# EAGLE board LED_matrix (EAGLE 7.7.0)
DRAWING_NUMBER: B001; DRAWN: Mario Blunk / Blunk electronic; PROJECT: LED-Matrix; STATUS: EDUCATION
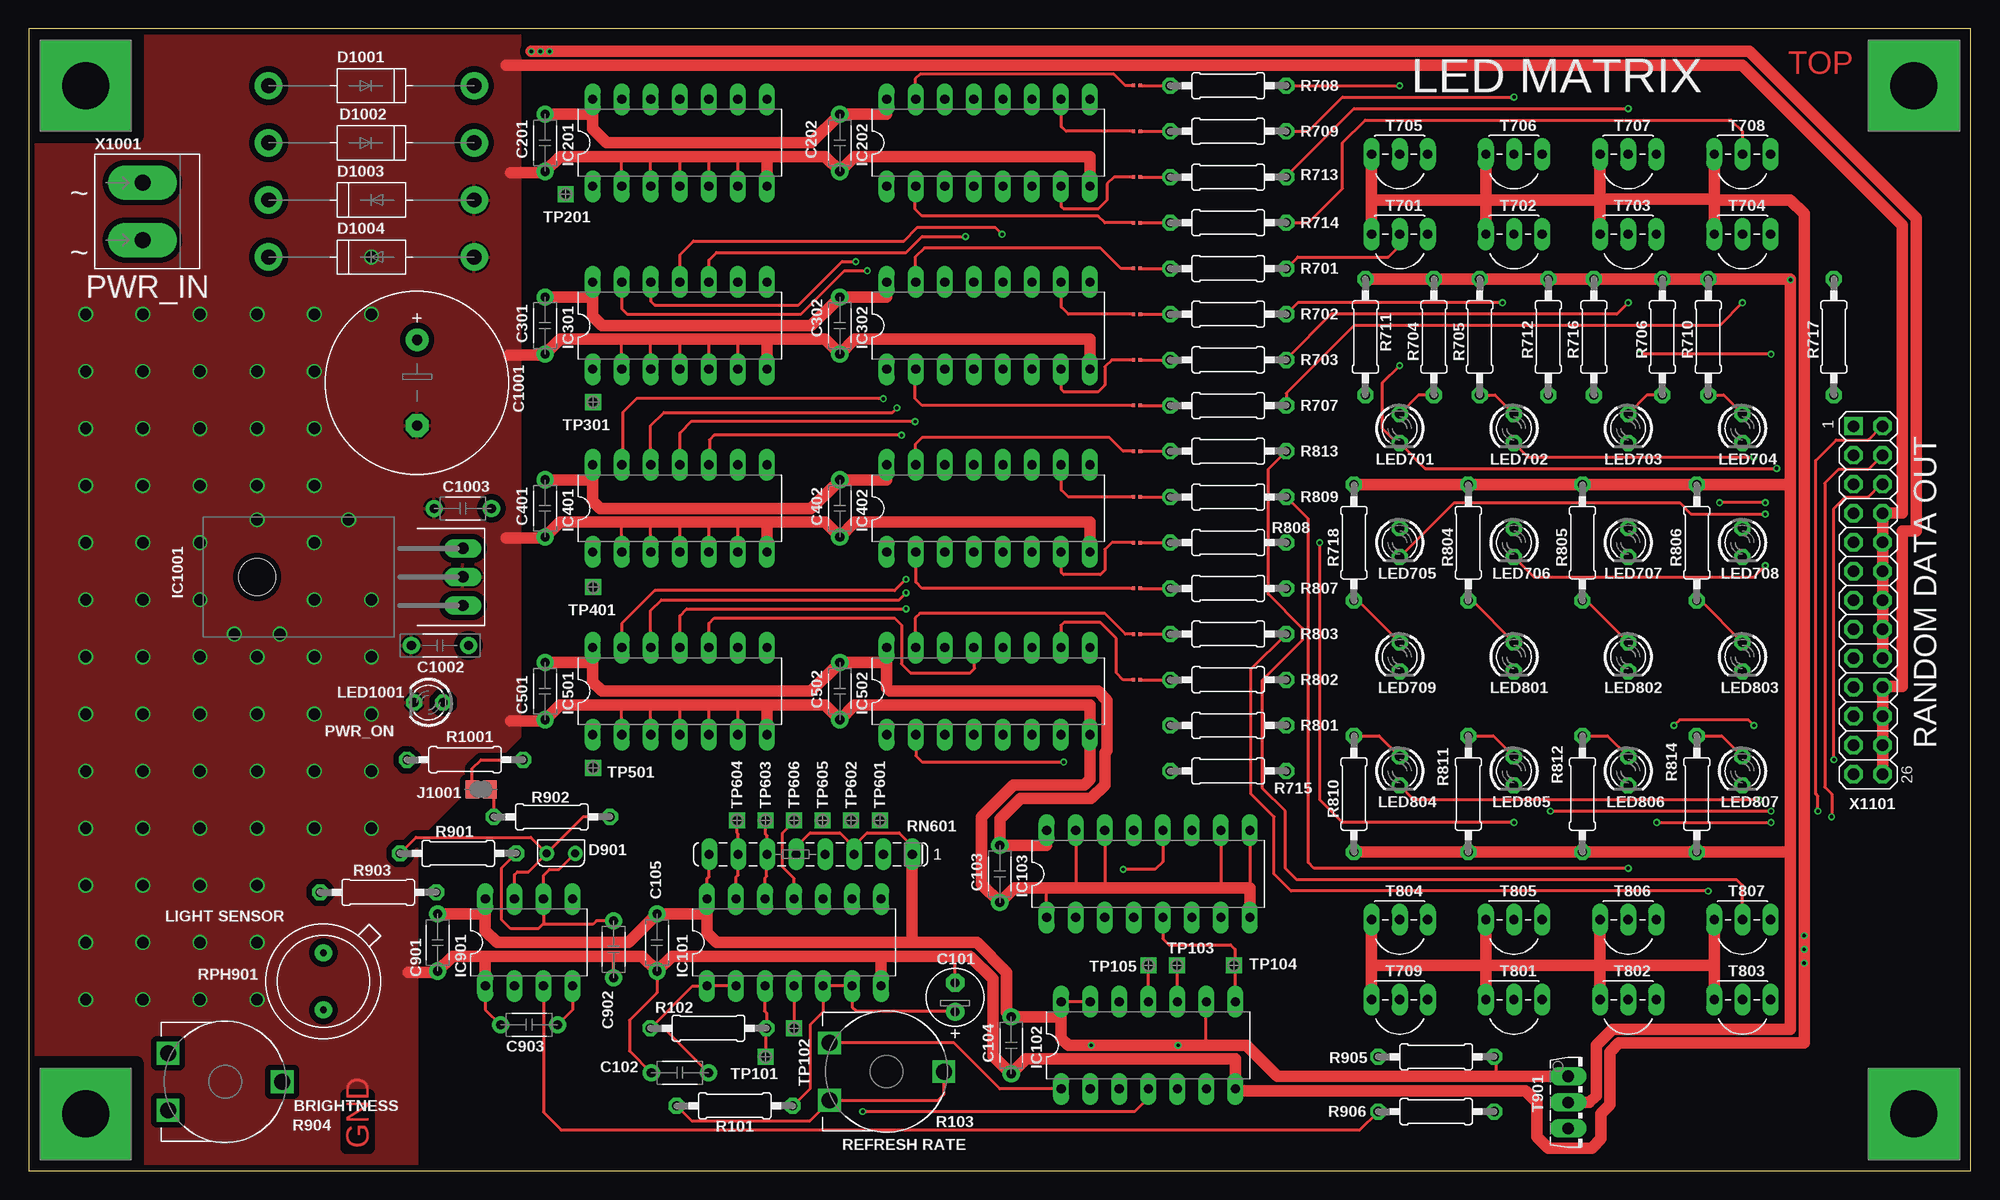
[diagram p11: board, top side]
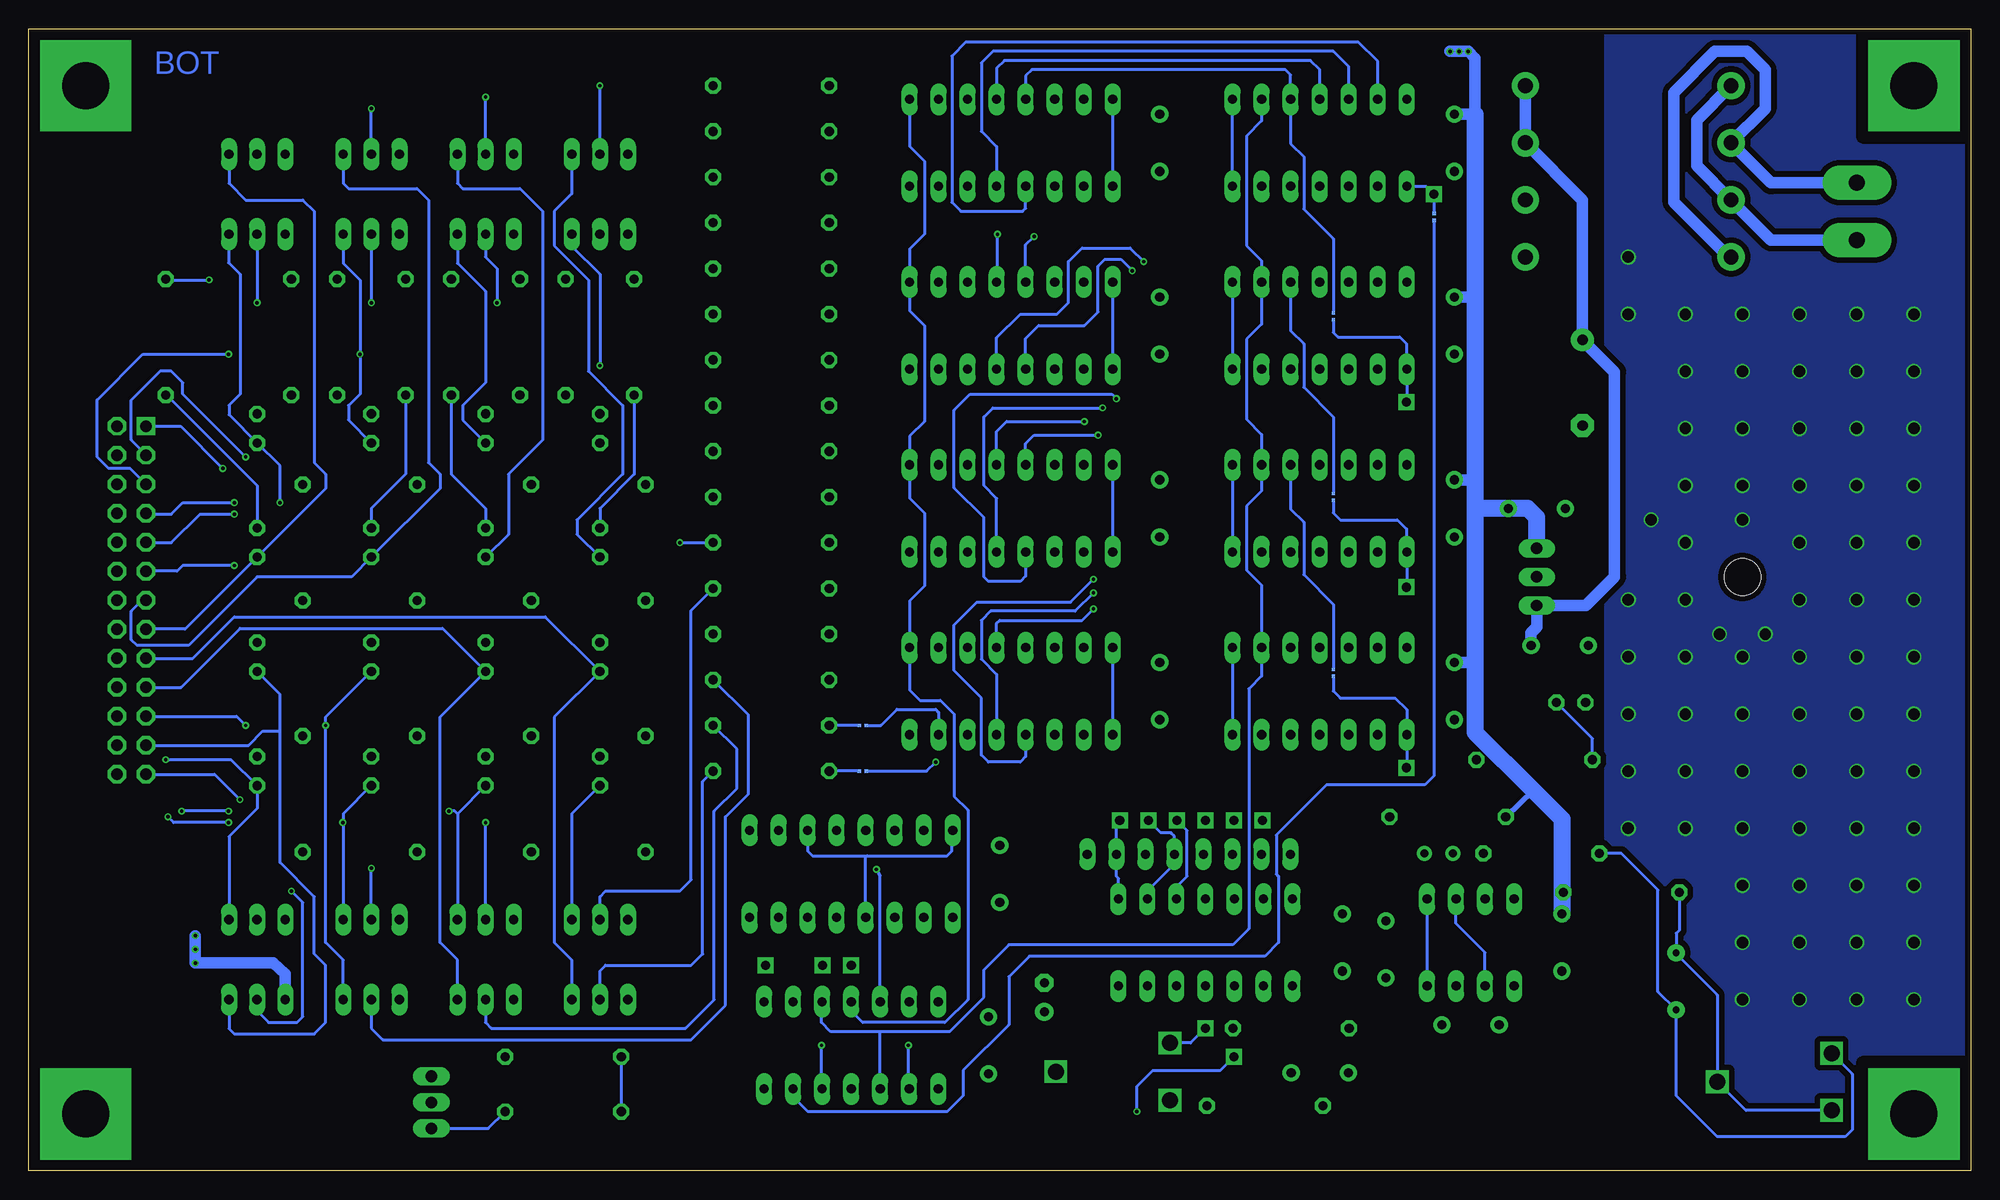
[diagram p12: board, bottom side, seen from below]

Size 170 x 100 mm. Coordinates in mm from the lower left corner, seen from the top.
Outline: 0,0 170,0 170,100 0,100 0,0
Copper layers (1*16): Top 0.035mm / dielectric 1.6mm / Bottom 0.035mm
Design rules "JLP_BL_std": minimum track width 0.15mm, minimum drill 0.3mm, track to track 0.15mm, track to pad 0.15mm, pad to pad 0.15mm, via to via 0.15mm, smd to smd 0.15mm, copper to edge 0.5mm, drill to drill 0.2mm, minimum pad ring 0.3mm, minimum via ring 0.15mm, stop-mask expansion 0.075mm, vias tented up to drill 0.3mm, thermal gap 0.2mm
Net classes: 1 pwr: width 0.3 mm

## Footprints (pad centres in the part's own frame; a part is rotated, then mirrored left to right if it is on the bottom)
T_RADIAL_5MM_GRID_2.54MM = drill 0.8 pad 1.6: + -1.27,0 | drill 0.8 pad 1.6 octagon: - 1.27,0
T_DISC_4MM_PITCH_5MM = drill 0.8 pad 1.5: 1 -2.5,0; 2 2.5,0
T_RADIAL_16MM_GRID_7.5MM = drill 0.9 pad 2: + -3.75,0 | drill 0.9 pad 2 octagon: - 3.75,0
T_DISC_7MM_PITCH_5MM = drill 0.8 pad 1.5: 1 -2.5,0; 2 2.5,0
T_MINIPLAST = drill 0.7: A 1.25,0; C -1.25,0
T_DO201_GRID_18MM = drill 1.3 pad 2.4: A -9,0; C 9,0
4.1_PAD = drill 4.1 pad 8 square: H1 0,0
T_NDIP14 = drill 0.8 long: 1 -7.62,-3.81; 2 -5.08,-3.81; 3 -2.54,-3.81; 4 0,-3.81; 5 2.54,-3.81; 6 5.08,-3.81; 7 7.62,-3.81; 8 7.62,3.81; 9 5.08,3.81; 10 2.54,3.81; 11 0,3.81; 12 -2.54,3.81; 13 -5.08,3.81; 14 -7.62,3.81
T_NDIP16 = drill 0.8 long: 1 -8.89,-3.81; 2 -6.35,-3.81; 3 -3.81,-3.81; 4 -1.27,-3.81; 5 1.27,-3.81; 6 3.81,-3.81; 7 6.35,-3.81; 8 8.89,-3.81; 9 8.89,3.81; 10 6.35,3.81; 11 3.81,3.81; 12 1.27,3.81; 13 -1.27,3.81; 14 -3.81,3.81; 15 -6.35,3.81; 16 -8.89,3.81
T_NDIP8 = drill 0.8 long: 1 -3.82,-3.81; 2 -1.28,-3.81; 3 1.26,-3.81; 4 3.8,-3.81; 5 3.8,3.81; 6 1.26,3.81; 7 -1.28,3.81; 8 -3.82,3.81
T_TO220-3_HORIZONTAL = drill 1 long: 1 -2.5,0; 2 0,0; 3 2.5,0 | hole 3.2: 0,18
S_SOLDER_JUMPER_NARROW = smd 1.168 x 1.6: 1 -0.762,0; 2 0.762,0
T_ROUND_3MM = drill 0.8 octagon: A -1.27,0; C 1.27,0
S_NET_CHANGER_0.3MM = smd 0.3 x 0.3: 1 -0.3,0; 2 0.3,0
T_0207_PITCH_10MM = drill 0.8 octagon: 1 -5.08,0; 2 5.08,0
T_TRIM_PIHER_PT10_HORIZONTAL = drill 1.4 square: A 2.5,-5; B -2.5,-5; W 0,5
T_SIL8 = drill 0.8 long: 1 -8.89,0; 2 -6.35,0; 3 -3.81,0; 4 -1.27,0; 5 1.27,0; 6 3.81,0; 7 6.35,0; 8 8.89,0
T_TO39-2 = drill 0.6 pad 1.5: 1 2.5,0; 2 -2.5,0
T_TO92-CBE = drill 0.813 long: B 0,0; C 2.46,0; E -2.46,0
T_TO126_VERTICAL = drill 1.016 long: B 2.286,-1.27; C 0,-1.27; E -2.286,-1.27
T_TEST_POINT_SMALL = drill 0.8 square: 1 0,0
T_WIRE_CLAMP_1X2_PITCH_5MM = drill 1.4 pad 3 long: 1 -2.5,-0.02; 2 2.5,-0.02
T_MALE_2X13_VERTICAL_PITCH_2MM54 = drill 1 square: 1 -15.2,-1.27 | drill 1 octagon: 2 -15.2,1.27; 3 -12.66,-1.27; 4 -12.66,1.27; 5 -10.12,-1.27; 6 -10.12,1.27; 7 -7.58,-1.27; 8 -7.58,1.27; 9 -5.04,-1.27; 10 -5.04,1.27; 11 -2.5,-1.27; 12 -2.5,1.27; 13 0.04,-1.27; 14 0.04,1.27; 15 2.58,-1.27; 16 2.58,1.27; 17 5.12,-1.27; 18 5.12,1.27; 19 7.66,-1.27; 20 7.66,1.27; 21 10.2,-1.27; 22 10.2,1.27; 23 12.74,-1.27; 24 12.74,1.27; 25 15.28,-1.27; 26 15.28,1.27

## Placement (x,y rotation side)
C101  1u  [T_RADIAL_5MM_GRID_2.54MM]  81.1,15.2 90 top
C102  100n  [T_DISC_4MM_PITCH_5MM]  57,8.6 180 top
C103  100n  [T_DISC_4MM_PITCH_5MM]  85,26 270 top
C104  100n  [T_DISC_4MM_PITCH_5MM]  86,11 270 top
C105  100n  [T_DISC_4MM_PITCH_5MM]  55,20 270 top
C201  100n  [T_DISC_4MM_PITCH_5MM]  45.2,90 270 top
C202  100n  [T_DISC_4MM_PITCH_5MM]  71,90 270 top
C301  100n  [T_DISC_4MM_PITCH_5MM]  45.2,74 270 top
C302  100n  [T_DISC_4MM_PITCH_5MM]  71,74 270 top
C401  100n  [T_DISC_4MM_PITCH_5MM]  45.2,58 270 top
C402  100n  [T_DISC_4MM_PITCH_5MM]  71,58 270 top
C501  100n  [T_DISC_4MM_PITCH_5MM]  45.2,42 270 top
C502  100n  [T_DISC_4MM_PITCH_5MM]  71,42 270 top
C901  100n  [T_DISC_4MM_PITCH_5MM]  35.8,20 270 top
C902  47n  [T_DISC_4MM_PITCH_5MM]  51.2,19.4 270 top
C903  10n  [T_DISC_4MM_PITCH_5MM]  43.8,12.8 180 top
C1001  470u  [T_RADIAL_16MM_GRID_7.5MM]  34,69 270 top
C1002  330n  [T_DISC_7MM_PITCH_5MM]  36,46 180 top
C1003  100n  [T_DISC_4MM_PITCH_5MM]  38,58 180 top
D901  SAY32  [T_MINIPLAST]  46.6,27.8 180 top
D1001  1N4001  [T_DO201_GRID_18MM]  30,95 0 top
D1002  1N4001  [T_DO201_GRID_18MM]  30,90 0 top
D1003  1N4001  [T_DO201_GRID_18MM]  30,85 180 top
D1004  1N4001  [T_DO201_GRID_18MM]  30,80 180 top
H601  HOLE_4.1_PAD  [4.1_PAD]  5,95 0 top
H602  HOLE_4.1_PAD  [4.1_PAD]  165,95 0 top
H603  HOLE_4.1_PAD  [4.1_PAD]  165,5 0 top
H604  HOLE_4.1_PAD  [4.1_PAD]  5,5 0 top
IC101  4093N  [T_NDIP14]  67,20 0 top
IC102  74LS00  [T_NDIP14]  98,11 0 top
IC103  74193N  [T_NDIP16]  98,26 0 top
IC201  7495N  [T_NDIP14]  57,90 0 top
IC202  74175N  [T_NDIP16]  84,90 0 top
IC301  7495N  [T_NDIP14]  57,74 0 top
IC302  74175N  [T_NDIP16]  84,74 0 top
IC401  7495N  [T_NDIP14]  57,58 0 top
IC402  74175N  [T_NDIP16]  84,58 0 top
IC501  7495N  [T_NDIP14]  57,42 0 top
IC502  74175N  [T_NDIP16]  84,42 0 top
IC901  NE555V  [T_NDIP8]  43.8,20 0 top
IC1001  7805_T_HORIZONTAL  [T_TO220-3_HORIZONTAL]  38,52 90 top
J1001  [S_SOLDER_JUMPER_NARROW]  39.6,33.4 180 top
LED701  [T_ROUND_3MM]  120,65 270 top
LED702  [T_ROUND_3MM]  130,65 270 top
LED703  [T_ROUND_3MM]  140,65 270 top
LED704  [T_ROUND_3MM]  150,65 270 top
LED705  [T_ROUND_3MM]  120,55 270 top
LED706  [T_ROUND_3MM]  130,55 270 top
LED707  [T_ROUND_3MM]  140,55 270 top
LED708  [T_ROUND_3MM]  150,55 270 top
LED709  [T_ROUND_3MM]  120,45 270 top
LED801  [T_ROUND_3MM]  130,45 270 top
LED802  [T_ROUND_3MM]  140,45 270 top
LED803  [T_ROUND_3MM]  150,45 270 top
LED804  [T_ROUND_3MM]  120,35 270 top
LED805  [T_ROUND_3MM]  130,35 270 top
LED806  [T_ROUND_3MM]  140,35 270 top
LED807  [T_ROUND_3MM]  150,35 270 top
LED1001  green  [T_ROUND_3MM]  35,41 180 top
N201  NET_CHANGER-S-0.3MM  [S_NET_CHANGER_0.3MM]  47,83.5 90 bottom
N301  NET_CHANGER-S-0.3MM  [S_NET_CHANGER_0.3MM]  55.8,74.8 270 bottom
N401  NET_CHANGER-S-0.3MM  [S_NET_CHANGER_0.3MM]  55.8,59 270 bottom
N501  NET_CHANGER-S-0.3MM  [S_NET_CHANGER_0.3MM]  55.8,43.6 270 bottom
N701  NET_CHANGER-S-0.3MM  [S_NET_CHANGER_0.3MM]  97,79 0 top
N702  NET_CHANGER-S-0.3MM  [S_NET_CHANGER_0.3MM]  97,75 0 top
N703  NET_CHANGER-S-0.3MM  [S_NET_CHANGER_0.3MM]  97,71 0 top
N704  NET_CHANGER-S-0.3MM  [S_NET_CHANGER_0.3MM]  97,67 0 top
N705  NET_CHANGER-S-0.3MM  [S_NET_CHANGER_0.3MM]  97,95 0 top
N706  NET_CHANGER-S-0.3MM  [S_NET_CHANGER_0.3MM]  97,91 0 top
N707  NET_CHANGER-S-0.3MM  [S_NET_CHANGER_0.3MM]  97,87 0 top
N708  NET_CHANGER-S-0.3MM  [S_NET_CHANGER_0.3MM]  97,83 0 top
N709  NET_CHANGER-S-0.3MM  [S_NET_CHANGER_0.3MM]  97,35 180 bottom
N801  NET_CHANGER-S-0.3MM  [S_NET_CHANGER_0.3MM]  97,39 180 bottom
N802  NET_CHANGER-S-0.3MM  [S_NET_CHANGER_0.3MM]  97,43 0 top
N803  NET_CHANGER-S-0.3MM  [S_NET_CHANGER_0.3MM]  97,47 0 top
N804  NET_CHANGER-S-0.3MM  [S_NET_CHANGER_0.3MM]  97,51 0 top
N805  NET_CHANGER-S-0.3MM  [S_NET_CHANGER_0.3MM]  97,55 0 top
N806  NET_CHANGER-S-0.3MM  [S_NET_CHANGER_0.3MM]  97,59 0 top
N807  NET_CHANGER-S-0.3MM  [S_NET_CHANGER_0.3MM]  97,63 0 top
R101  10k  [T_0207_PITCH_10MM]  61.8,5.7 180 top
R102  10k  [T_0207_PITCH_10MM]  59.5,12.5 0 top
R103  50k  [T_TRIM_PIHER_PT10_HORIZONTAL]  75.1,8.7 270 top
R701  2k7  [T_0207_PITCH_10MM]  105,79 0 top
R702  2k7  [T_0207_PITCH_10MM]  105,75 0 top
R703  2k7  [T_0207_PITCH_10MM]  105,71 0 top
R704  330  [T_0207_PITCH_10MM]  123,73 270 top
R705  330  [T_0207_PITCH_10MM]  127,73 270 top
R706  330  [T_0207_PITCH_10MM]  143,73 270 top
R707  2k7  [T_0207_PITCH_10MM]  105,67 0 top
R708  2k7  [T_0207_PITCH_10MM]  105,95 0 top
R709  2k7  [T_0207_PITCH_10MM]  105,91 0 top
R710  330  [T_0207_PITCH_10MM]  147,73 270 top
R711  330  [T_0207_PITCH_10MM]  117,73 270 top
R712  330  [T_0207_PITCH_10MM]  133,73 270 top
R713  2k7  [T_0207_PITCH_10MM]  105,87 0 top
R714  2k7  [T_0207_PITCH_10MM]  105,83 0 top
R715  2k7  [T_0207_PITCH_10MM]  105,35 0 top
R716  330  [T_0207_PITCH_10MM]  137,73 270 top
R717  330  [T_0207_PITCH_10MM]  158,73 270 top
R718  330  [T_0207_PITCH_10MM]  116,55 270 top
R801  2k7  [T_0207_PITCH_10MM]  105,39 0 top
R802  2k7  [T_0207_PITCH_10MM]  105,43 0 top
R803  2k7  [T_0207_PITCH_10MM]  105,47 0 top
R804  330  [T_0207_PITCH_10MM]  126,55 270 top
R805  330  [T_0207_PITCH_10MM]  136,55 270 top
R806  330  [T_0207_PITCH_10MM]  146,55 270 top
R807  2k7  [T_0207_PITCH_10MM]  105,51 0 top
R808  2k7  [T_0207_PITCH_10MM]  105,55 0 top
R809  2k7  [T_0207_PITCH_10MM]  105,59 0 top
R810  330  [T_0207_PITCH_10MM]  116,33 90 top
R811  330  [T_0207_PITCH_10MM]  126,33 90 top
R812  330  [T_0207_PITCH_10MM]  136,33 90 top
R813  2k7  [T_0207_PITCH_10MM]  105,63 0 top
R814  330  [T_0207_PITCH_10MM]  146,33 90 top
R901  1k2  [T_0207_PITCH_10MM]  37.6,27.8 180 top
R902  not fitted  [T_0207_PITCH_10MM]  45.8,31 180 top
R903  1k  [T_0207_PITCH_10MM]  30.6,24.4 0 top
R904  1M  [T_TRIM_PIHER_PT10_HORIZONTAL]  17.2,7.8 270 top
R905  10k  [T_0207_PITCH_10MM]  123.2,10 0 top
R906  330  [T_0207_PITCH_10MM]  123.2,5.2 0 top
R1001  330  [T_0207_PITCH_10MM]  38.2,36 180 top
RN601  10k  [T_SIL8]  68.45,27.72 180 top
RPH901  [T_TO39-2]  25.8,16.6 90 top
T701  BC548C  [T_TO92-CBE]  120,82 0 top
T702  BC548C  [T_TO92-CBE]  130,82 0 top
T703  BC548C  [T_TO92-CBE]  140,82 0 top
T704  BC548C  [T_TO92-CBE]  150,82 0 top
T705  BC548C  [T_TO92-CBE]  120,89 0 top
T706  BC548C  [T_TO92-CBE]  130,89 0 top
T707  BC548C  [T_TO92-CBE]  140,89 0 top
T708  BC548C  [T_TO92-CBE]  150,89 0 top
T709  BC548C  [T_TO92-CBE]  120,15 0 top
T801  BC548C  [T_TO92-CBE]  130,15 0 top
T802  BC548C  [T_TO92-CBE]  140,15 0 top
T803  BC548C  [T_TO92-CBE]  150,15 0 top
T804  BC548C  [T_TO92-CBE]  120,22 0 top
T805  BC548C  [T_TO92-CBE]  130,22 0 top
T806  BC548C  [T_TO92-CBE]  140,22 0 top
T807  BC548C  [T_TO92-CBE]  150,22 0 top
T901  BD136  [T_TO126_VERTICAL]  136,6 270 top
TP101  [T_TEST_POINT_SMALL]  64.5,10 180 top
TP102  [T_TEST_POINT_SMALL]  67,12.5 0 top
TP103  [T_TEST_POINT_SMALL]  100.5,18 0 top
TP104  [T_TEST_POINT_SMALL]  105.5,18 0 top
TP105  [T_TEST_POINT_SMALL]  98,18 0 top
TP201  [T_TEST_POINT_SMALL]  47,85.5 180 top
TP301  [T_TEST_POINT_SMALL]  49.4,67.3 180 top
TP401  [T_TEST_POINT_SMALL]  49.4,51.1 180 top
TP501  [T_TEST_POINT_SMALL]  49.4,35.3 180 top
TP601  [T_TEST_POINT_SMALL]  74.5,30.7 0 top
TP602  [T_TEST_POINT_SMALL]  72,30.7 180 top
TP603  [T_TEST_POINT_SMALL]  64.5,30.7 180 top
TP604  [T_TEST_POINT_SMALL]  62,30.7 180 top
TP605  [T_TEST_POINT_SMALL]  69.5,30.7 0 top
TP606  [T_TEST_POINT_SMALL]  67,30.7 0 top
U$1  [A4_LANDSCAPE]  -32.8,-56.4 0 top  (outside the outline)
X1001  CLAMP_1X2-T-5MM  [T_WIRE_CLAMP_1X2_PITCH_5MM]  10,84 270 top
X1101  MALE_2X13-T-VERTICAL_PITCH_2MM54  [T_MALE_2X13_VERTICAL_PITCH_2MM54]  161,50 270 top

## Tracks (layer width: path | path; a pad name or v marks a point on that pad's centre or on a via)
CLK_FAST
  Bottom 0.25: N201.1 47,34.6 47.8,33.8 56.4,33.8 60.8,29.4 60.8,26 60.6,25.8 60.6,20 61.8,18.8 82.4,18.8 84.2,17 84.2,12.8 88.2,8.8 88.2,6.6 89.6,5.2 101.8,5.2 103,6.4 103,7.11 IC102.6
CLK_FAST_OSC  (via drill 0.3)
  Top 0.25: IC101.3 64.4,16.13 64.4,14 64.58,13.82 R102.2 64.5,12.42 TP101.1 | IC102.4 98,6.4 96.8,5.2 v73,5.2
  Bottom 0.25: v73,5.2 73,7.4 71.6,8.8 65.7,8.8 TP101.1
CLK_FAST_RC
  Top 0.25: IC101.2 IC101.1 58.11,16.19 R102.1 55.6,12.5 C102.1
CLK_SLOW
  Top 0.25: IC102.8 105.62,17.88 TP104.1 105.6,18.1 105.6,19.4 105.2,19.8 99.8,19.8 99.27,20.33 IC103.5
CLK_SLOW_N
  Top 0.25: IC102.10 100.54,17.96 TP103.1
  Bottom 0.25: IC102.3 95.46,12.2 | 95.46,12.2 89.4,12.2 86.4,15.2 86.4,17.6 84.2,19.8 64.6,19.8 63.2,21.2 63.2,42.2 62.08,43.32 IC501.9 62.08,51.28 63.4,52.6 63.4,58.2 62.08,59.52 IC401.9 62.08,64.48 63.4,65.8 63.4,72.8 62.08,74.12 IC301.9 62.08,79.68 63.4,81 63.4,90.6 62.08,91.92 IC201.9 | 95.46,12.2 99.8,12.2 100.6,13 100.6,14.75 IC102.10
CLK_SLOW_OSC
  Top 0.25: IC101.4 TP102.1 | IC102.1 85.01,7.19 81,11.2 R103.B
  Bottom 0.25: TP102.1 68.3,11.2 R103.B
CLK_SLOW_RA
  Top 0.25: R101.2 58.02,4.4 68.4,4.4 70.1,6.1 R103.A 79.6,6.2 80.1,6.7 R103.W
CLK_SLOW_RC
  Top 0.25: R101.1 66.9,5.7 68.4,7.2 68.4,12.8 69.54,13.94 IC101.5 IC101.6 72.08,14.32 72.4,14 81.03,14 C101.+
CT_CO_N  (via drill 0.3)
  Top 0.25: IC103.12 99.27,27.07 98.6,26.4 v95.8,26.4
  Bottom 0.25: IC102.12 95.46,25.86 v95.8,26.4
DRV_IN_1
  Top 0.25: N701.2 R701.1
DRV_IN_2
  Top 0.25: N702.2 R702.1
DRV_IN_3
  Top 0.25: N703.2 R703.1
DRV_IN_4
  Top 0.25: N704.2 R707.1
DRV_IN_5
  Top 0.25: N705.2 R708.1
DRV_IN_6
  Top 0.25: N706.2 R709.1
DRV_IN_7
  Top 0.25: N707.2 R713.1
DRV_IN_8
  Top 0.25: N708.2 R714.1
DRV_IN_9
  Bottom 0.25: N709.2 R715.1
DRV_IN_10
  Bottom 0.25: N801.2 R801.1
DRV_IN_11
  Top 0.25: N802.2 R802.1
DRV_IN_12
  Top 0.25: N803.2 R803.1
DRV_IN_13
  Top 0.25: N804.2 R807.1
DRV_IN_14
  Top 0.25: N805.2 R808.1
DRV_IN_15
  Top 0.25: N806.2 R809.1
DRV_IN_16
  Top 0.25: N807.2 R813.1
DRV_IN_B1
  Top 0.25: R701.2 111.08,80 119,80 120,81 T701.B
DRV_IN_B2  (via drill 0.3)
  Top 0.25: v129,76 111.08,76 R702.2
  Bottom 0.25: T702.B 130,80 129,79 v129,76
DRV_IN_B3  (via drill 0.3)
  Top 0.25: v140,76 139,75 114,75 110.08,71.08 R703.2
  Bottom 0.25: T703.B v140,76
DRV_IN_B4  (via drill 0.3)
  Top 0.25: v150,76 148,74 116,74 110.08,68.08 R707.2
  Bottom 0.25: T704.B v150,76
DRV_IN_B5  (via drill 0.3)
  Top 0.25: R708.2 v120,95
  Bottom 0.25: T705.B v120,95
DRV_IN_B6  (via drill 0.3)
  Top 0.25: R709.2 112,91 115,94 v130,94
  Bottom 0.25: T706.B v130,94
DRV_IN_B7  (via drill 0.3)
  Top 0.25: R713.2 110.08,87.08 116,93 v140,93
  Bottom 0.25: T707.B v140,93
DRV_IN_B8
  Top 0.25: R714.2 112,83 115,86 115,90 117,92 149,92 150,91 T708.B
DRV_IN_B9
  Bottom 0.25: T709.B 120,17.5 119.5,18 112,18 111,19 111,34.08 R715.2
DRV_IN_B10
  Bottom 0.25: T801.B 130,13 129.5,12.5 112.5,12.5 110,15 110,31.5 108,33.5 108,36.92 R801.2
DRV_IN_B11
  Bottom 0.25: T802.B 140,12.5 139,11.5 112,11.5 109,14.5 109,31 107,33 107,39.92 R802.2
DRV_IN_B12  (via drill 0.3)
  Top 0.25: v147,24.5 110.5,24.5 109,26 109,31 107,33 107,43.92 R803.2
  Bottom 0.25: T803.B 150,14 149,13 146.5,13 146,13.5 146,23.5 v147,24.5
DRV_IN_B13
  Bottom 0.25: T804.B 120,24 119.5,24.5 113,24.5 112,25.5 112,49.08 R807.2
DRV_IN_B14  (via drill 0.3)
  Top 0.25: v130,30.5 115,30.5 113,32.5 v113,55
  Bottom 0.25: T805.B v130,30.5 | v113,55 R808.2
DRV_IN_B15  (via drill 0.3)
  Top 0.25: v140,26.5 112.5,26.5 112,27 112,57.08 R809.2
  Bottom 0.25: T806.B v140,26.5
DRV_IN_B16
  Top 0.25: T807.B 150,25 149.5,25.5 111,25.5 110,26.5 110,31.5 108,33.5 108,43 111.5,46.5 111.5,47.5 108.5,50.5 108.5,61.42 R813.2
DRV_OUT_1  (via drill 0.3)
  Top 0.25: v120,70.5 118.5,69 118.5,65 119.77,63.73 LED701.C 122.23,61.5 v153,61.5
  Bottom 0.25: T701.C 122.46,80.96 120,78.5 v120,70.5 | X1101.1 156.7,65.2 v153,61.5
DRV_OUT_2  (via drill 0.3)
  Top 0.25: LED702.C 131.23,62.5 v151,62.5
  Bottom 0.25: T702.C 132.46,79.46 130,77 130,69 132,67 132,65.73 LED702.C | X1101.3 159.73,62.73 161,64 161,67.5 158.5,70 157.5,70 156.5,69 156.5,68 v151,62.5
DRV_OUT_3  (via drill 0.3)
  Top 0.25: v152.5,71.5 v141,71.5
  Bottom 0.25: T703.C 142.46,79.46 141,78 v141,71.5 141,68 142,67 142,65.73 LED703.C | X1101.5 161.11,61.5 163,61.5 164,62.5 164,67.5 160,71.5 v152.5,71.5
DRV_OUT_4  (via drill 0.3)
  Top 0.25: v152,58.5 v148,58.5
  Bottom 0.25: T704.C 152.5,79.5 151.5,78.5 151.5,68 152.46,67.04 152.46,66.19 LED704.C 148,61.73 v148,58.5 | X1101.7 159.65,57.5 157.5,57.5 156.5,58.5 v152,58.5
DRV_OUT_5  (via drill 0.3)
  Top 0.25: LED705.C 124.77,58.5 144.5,58.5 145.5,57.5 v152,57.5
  Bottom 0.25: T705.C 122.46,85.54 124,84 124,81 121,78 121,70 118,67 118,61 122,57 122,55.73 LED705.C | X1101.9 159.69,55 157.5,55 155,57.5 v152,57.5
DRV_OUT_6  (via drill 0.3)
  Top 0.25: LED706.C 131.73,52 151,52 v152,53
  Bottom 0.25: T706.C 132.46,86.46 132,86 127,86 125,84 125,64 128,61 128,55.73 LED706.C | v152,53 156.5,53 157,52.5 X1101.11
DRV_OUT_7
  Bottom 0.25: T707.C 142.46,86.46 142,86 136,86 135,85 135,62 134,61 134,59.73 LED707.C 141.73,52 150,52 156,46 160.5,46 161,46.5 161,49 160.04,49.96 X1101.13
DRV_OUT_8
  Bottom 0.25: T708.C 152.46,86.46 151,85 146,85 145,84 145,62 144,61 144,59.73 LED708.C 156.31,47.42 X1101.15
DRV_OUT_9
  Bottom 0.25: T709.C 122.46,18.46 124,20 124,39.73 LED709.C 124.77,48.5 152,48.5 155.62,44.88 X1101.17
DRV_OUT_10
  Bottom 0.25: T801.C 132.46,18.46 134,20 134,39.73 LED801.C 133.77,47.5 151.5,47.5 156.66,42.34 X1101.19
DRV_OUT_11  (via drill 0.3)
  Top 0.25: v151,39 150.5,39.5 144.5,39.5 v144,39
  Bottom 0.25: T802.C 142.46,18.46 144,20 v144,39 144,39.73 LED802.C | X1101.21 151.8,39.8 v151,39
DRV_OUT_12
  Bottom 0.25: T803.C 152.46,12.46 152,12 145,12 144,13 144,18 145,19 145,24 148,27 148,38.5 | 148,38.5 148,41.73 LED803.C | X1101.23 150.74,37.26 149.5,38.5 148,38.5
DRV_OUT_13  (via drill 0.3)
  Top 0.25: v151.5,32.5 121.23,32.5 LED804.C
  Bottom 0.25: LED804.C 122.46,31.27 T804.C | X1101.25 153.72,34.72 v151.5,32.5
DRV_OUT_14  (via drill 0.3)
  Top 0.25: v133.2,31.5 v152.5,31.5 | v156.6,31.5 156.6,32.8 156.4,33 156.4,62.2 158.2,64 161,64 162.2,65.2 X1101.2
  Bottom 0.25: LED805.C 132.46,31.27 | 132.46,31.27 T805.C | 132.46,31.27 132.69,31.5 v133.2,31.5 | v152.5,31.5 v156.6,31.5
DRV_OUT_15  (via drill 0.3)
  Top 0.25: v142.5,30.5 v152.5,30.5 | X1101.4 161.01,61.4 158.4,61.4 157.2,60.2 157.2,33.6 157.8,33 v157.8,31
  Bottom 0.25: LED806.C 142.46,31.27 142.46,30.5 | 142.46,30.5 T806.C | v142.5,30.5 142.46,30.5 | v152.5,30.5 157.3,30.5 v157.8,31
DRV_OUT_16  (via drill 0.3)
  Top 0.25: v158,36 158,58 159,59 161,59 162.12,60.12 X1101.6
  Bottom 0.25: T807.C 152.46,29.27 150,31.73 LED807.C 152.27,36 v158,36
DRV_OUT_A_1
  Top 0.25: R704.2 121.65,67.92 LED701.A
DRV_OUT_A_2
  Top 0.25: R705.2 128.35,67.92 LED702.A
DRV_OUT_A_3
  Top 0.25: R706.2 141.65,67.92 LED703.A
DRV_OUT_A_4
  Top 0.25: R710.2 148.35,67.92 LED704.A
DRV_OUT_A_5
  Bottom 0.25: R711.2 117,61 120,58 LED705.A
DRV_OUT_A_6
  Bottom 0.25: R712.2 133,61 130,58 LED706.A
DRV_OUT_A_7
  Bottom 0.25: R716.2 137,61 140,58 LED707.A
DRV_OUT_A_8
  Bottom 0.25: R717.2 157.92,67.92 150,60 LED708.A
DRV_OUT_A_9
  Top 0.25: R718.2 116.35,49.92 LED709.A
DRV_OUT_A_10
  Top 0.25: R804.2 126.35,49.92 LED801.A
DRV_OUT_A_11
  Top 0.25: R805.2 136.35,49.92 LED802.A
DRV_OUT_A_12
  Top 0.25: R806.2 146.35,49.92 LED803.A
DRV_OUT_A_13
  Top 0.25: R810.2 118.19,38.08 LED804.A
DRV_OUT_A_14
  Top 0.25: R811.2 128.19,38.08 LED805.A
DRV_OUT_A_15
  Top 0.25: R812.2 138.19,38.08 LED806.A
DRV_OUT_A_16
  Top 0.25: R814.2 148.19,38.08 LED807.A
GND  (via drill 0.3, 1)
  Top 0.25: IC201.2 51.92,88.72 52,88.8 | IC201.3 54.46,88.34 54,88.8 | IC201.4 57,88.8 | IC201.5 59.54,88.34 60,88.8 | IC201.6 62.08,88.72 62,88.8 | IC301.2 51.92,72.72 52,72.8 | IC301.3 54.46,72.8 55,72.8 | IC301.4 57,72.8 | IC301.5 59.54,72.8 59,72.8 | IC301.6 62.08,72.8 62,72.8 | IC401.2 51.92,56.8 52,56.8 | IC401.3 54.46,56.8 55,56.8 | IC401.4 57,56.8 | IC401.5 59.54,56.8 59,56.8 | IC401.6 62.08,56.8 62,56.8 | IC501.2 51.92,40.8 52,40.8 | IC501.3 54.46,40.8 55,40.8 | IC501.4 57,40.8 | IC501.5 59.54,40.8 59,40.8 | IC501.6 62.08,40.8 62,40.8 | IC103.15 91.65,24.8 92,24.8 | IC103.14 94.19,24.8 94,24.8 | IC103.10 104.35,25 105,25 105,24.8 | IC103.9 106.89,24.8 | IC103.1 89.11,24.8 89,24.8 | IC901.1 39.98,14.12 C903.2 | C902.2 51.2,18.8 | C105.2 55,15.6 52.6,13.2 52.6,10.5 C102.2 | C101.- 81.1,18.7 81,18.8
  Top 1: IC202.8 92.89,88.8 72.3,88.8 C202.2 69.7,88.8 64.6,88.8 | 64.6,88.8 62,88.8 60,88.8 57,88.8 54,88.8 52,88.8 46.5,88.8 C201.2 45.1,87.4 42.2,87.4 | IC201.7 64.62,88.78 64.6,88.8 | IC302.8 92.89,72.8 72.3,72.8 C302.2 69.7,72.8 64.6,72.8 | 64.6,72.8 62,72.8 59,72.8 57,72.8 55,72.8 52,72.8 46.5,72.8 C301.2 45.1,71.4 42,71.4 | IC301.7 64.62,72.78 64.6,72.8 | IC402.8 92.89,56.8 72.3,56.8 C402.2 69.7,56.8 64.62,56.8 | 64.62,56.8 62,56.8 59,56.8 57,56.8 55,56.8 52,56.8 46.5,56.8 C401.2 45.1,55.4 41.8,55.4 | IC401.7 64.62,56.8 | 64.8,40.8 69.7,40.8 C502.2 72.3,40.8 92.89,40.8 IC502.8 92.89,34.29 92.4,33.8 86.2,33.8 83.4,31 83.4,25.1 C103.2 86.3,24.8 89,24.8 92,24.8 94,24.8 105,24.8 106.89,24.8 IC103.8 | 64.8,40.8 62,40.8 59,40.8 57,40.8 55,40.8 52,40.8 46.5,40.8 C501.2 45.1,39.4 42.2,39.4 | IC501.7 64.62,40.62 64.8,40.8 | IC101.7 74.62,18.8 | 74.62,18.8 56.3,18.8 C105.2 53.7,18.8 51.2,18.8 39.98,18.8 | 74.62,18.8 81,18.8 82.4,18.8 84.4,16.8 84.4,10.1 C104.2 87.3,9.8 105.62,9.8 IC102.7 105.81,7 131,7 132,6 132,3 133,2 136.8,2 137.6,2.8 137.6,5 138.4,5.8 138.4,10.4 139.2,11.2 155.4,11.2 v155.4,18.2 v155.4,19.4 v155.4,20.6 155.4,83.8 154.2,85 147.54,85 | 39.98,18.8 37.1,18.8 C901.2 35.7,17.4 33.2,17.4 | IC901.1 39.98,18.8 | T708.E 147.54,85.05 | 147.54,85.05 147.54,85 | 147.54,85 T704.E | T707.E 137.54,85 | 137.54,85 T703.E | T706.E 127.54,85 | 127.54,85 T702.E | T705.E 117.54,85 | 117.54,85 T701.E | 147.54,85.05 137.59,85.05 137.54,85 | 137.54,85 127.54,85 | 127.54,85 117.54,85 | T807.E 147.54,18.15 | 147.54,18.15 T803.E | T806.E 137.54,18 | 137.54,18 T802.E | T805.E 127.54,18 | 127.54,18 T801.E
  Top 1: T804.E 117.54,18 | 117.54,18 T709.E | 147.54,18.15 147.39,18 137.54,18 | 137.54,18 127.54,18 | 127.54,18 117.54,18 | X1101.18 X1101.16 X1101.14 X1101.12 X1101.10 X1101.8 164,57.58 164,82.8 150,96.8 41.8,96.8
  Bottom 0.25: IC201.7 IC201.8 | IC301.8 IC301.7 | IC501.8 IC501.7 | IC401.8 IC401.7
  Bottom 1: T803.E 147.54,17.26 148.6,18.2 v155.4,18.2 v155.4,19.4 v155.4,20.6
  other vias: 5,75 10,75 15,75 20,75 5,70 10,70 15,70 20,70 25,75 25,70 20,65 25,65 15,65 10,65 5,65 5,60 10,60 10,55 10,50 5,50 5,45 10,45 5,40 10,40 15,40 20,40 25,40 25,35 20,35 15,35 10,35 5,35 5,30 10,30 15,30 20,30 25,30 5,25 10,25 15,25 20,25 20,20 15,20 10,20 5,20 5,15 10,15 15,15 20,15 30,40 30,35 30,30 30,75 30,80 5,55 15,60 20,60 25,60 15,55 15,50 15,45 20,45 25,45 30,45 25,50 25,55 30,50 20,57 28,57 22,47 18,47
  pour Top (isolate 0.5): 43,100 0,100 0,0 34,0 34,29 43,38
  pour Bottom (isolate 0.5): 0,100 32,100 32,0 0,0
P5V  (via drill 0.3)
  Top 0.25: J1001.1 40.72,33.04 R902.2 | IC102.13 IC102.14 | IC101.14 59.4,23.83 59.4,25.6 59.56,25.76 RN601.8 | RN601.5 67.18,28.38 68.4,29.6 71,29.6 72.26,28.34 RN601.3 72.26,28.46 73.4,29.6 76.2,29.6 77.34,28.46 RN601.1 | R905.2 128.4,9.88 128.4,8.29 | IC102.9 103,14.81 103,11
  Top 1: IC202.16 75.11,92.5 C202.1 68.5,90 50.6,90 49.38,91.22 IC201.14 49.38,92.5 C201.1 | IC302.16 75.11,76.5 C302.1 68.5,74 50.2,74 49.38,74.82 IC301.14 49.38,76.5 C301.1 | IC401.14 49.38,60.5 | 49.38,60.5 C401.1 | IC402.16 75.11,60.5 C402.1 68.5,58 50,58 49.38,58.62 49.38,60.5 | IC502.16 75.11,44.5 | 75.11,44.5 C502.1 68.5,42 50.2,42 49.38,42.82 IC501.14 49.38,44.5 C501.1 | IC103.16 89.11,28.5 C103.1 85,30.8 86.8,32.6 93,32.6 94.2,33.8 94.2,36.6 94.4,36.8 94.4,41.2 93.6,42 75.4,42 75.11,42.29 75.11,44.5 | IC102.14 90.38,13.5 | 90.38,13.5 C104.1 85.6,13.9 85.6,17.4 83,20 77.34,20 | 77.34,20 60.2,20 59.38,20.82 IC101.14 59.38,22.5 C105.1 52.5,20 41,20 39.98,21.02 IC901.8 39.98,22.5 C901.1 | 77.34,20 RN601.1 | 90.38,13.5 90.38,11.62 91,11 v93,11 v100.6,11 103,11 106.6,11 109.31,8.29 128.4,8.29 T901.E | X1101.26 X1101.24 X1101.22 X1101.20 162.27,42.4 164,42.4 164,56 165.2,56 165.2,83.4 150.6,98 v45.6,98 v44.8,98 v44,98
  Bottom 0.25: IC202.1 IC202.16 | IC302.1 IC302.16 | IC402.1 IC402.16 | IC502.1 IC502.16 | IC103.11 101.81,28.01 101.4,27.6 96.6,27.6 | 96.6,27.6 89.6,27.6 89.2,28 89.2,29.72 IC103.16 | IC103.4 96.73,27.47 96.6,27.6 | IC102.2 arc90 93,7.27 v93,11 | IC102.5 arc90 100.6,7.25 v100.6,11 | R903.2 35.68,24.68 35.8,24.8
  Bottom 0.5: R902.2 38.3,33.3
  Bottom 1: C201.1 43.4,92.5 43.4,97.4 v44,98 v45.6,98 | 43.4,76.5 C301.1 | 43.4,60.5 C401.1 | 43.4,44.5 C501.1
  Bottom 1.5: 43.4,92.5 43.4,76.5 43.4,60.5 43.4,58 | 43.4,58 43.4,44.5 43.4,38.4 38.3,33.3 35.8,30.8 35.8,24.8 C901.1 | IC1001.3 38,57.2 38.8,58 C1003.1 43.4,58
PWR_IN_AC1
  Bottom 1: X1001.2 17.5,81.5 D1003.C 24,88 24,92 D1001.A
PWR_IN_AC2
  Bottom 1: X1001.1 17.5,86.5 D1002.A 18,93 18,96.4 19.6,98 22.4,98 26,94.4 26,84.8 21.2,80 D1004.C
PWR_IN_VREG
  Bottom 1: C1002.1 38.5,47.1 38,47.6 IC1001.1 33.7,49.5 31.2,52 31.2,69.95 C1001.+ 34,85 D1002.C D1001.C
PWR_LED
  Bottom 0.25: R1001.2 33.12,37.85 LED1001.A
PWR_LED_JP
  Top 0.25: J1001.2 38.84,35.24 39.6,36 R1001.1
REG_1_QA
  Top 0.25: N708.1 94.2,83 93.6,83.6 78.2,83.6 77.6,84.2 77.6,86.14 IC202.2
REG_1_QB
  Top 0.25: N707.1 95,87 94.4,86.4 94.4,85 93.6,84.2 90.6,84.2 90.4,84.4 90.4,86.14 IC202.7
REG_1_QC
  Top 0.25: N706.1 90.8,91 90.4,91.4 90.4,93.76 IC202.10
REG_1_QD
  Top 0.25: N705.1 96,95 95,96 78,96 77.6,95.6 77.6,93.86 IC202.15
REG_2_QA
  Top 0.25: N704.1 78.2,67 77.6,67.6 77.6,70.14 IC302.2
REG_2_QB
  Top 0.25: N703.1 94.8,71 94.2,70.4 94.2,68.8 93.6,68.2 90.6,68.2 90.4,68.4 90.4,70.14 IC302.7
REG_2_QC
  Top 0.25: N702.1 91,75 90.4,75.6 90.4,77.76 IC302.10
REG_2_QD
  Top 0.25: N701.1 95.6,79 93.8,80.8 78.4,80.8 77.6,80 77.6,77.86 IC302.15
REG_3_QA
  Top 0.25: N804.1 78.2,51 77.65,51.55 IC402.2
REG_3_QB
  Top 0.25: N805.1 94.8,55 94.2,54.4 94.2,52.6 93.8,52.2 90.6,52.2 90.4,52.4 90.4,54.14 IC402.7
REG_3_QC
  Top 0.25: N806.1 91,59 90.4,59.6 90.4,61.76 IC402.10
REG_3_QD
  Top 0.25: N807.1 95.8,63 94.6,64.2 78.2,64.2 77.6,63.6 77.6,61.86 IC402.15
REG_4_QA  (via drill 0.3)
  Top 0.25: IC502.2 77.65,36.35 78.2,35.8 v90.6,35.8
  Bottom 0.25: N709.1 91.4,35 v90.6,35.8
REG_4_QB
  Bottom 0.25: N801.1 95.4,39 94,40.4 90.6,40.4 90.35,40.15 IC502.7
REG_4_QC
  Top 0.25: N802.1 95.8,43 95.2,43.6 95.2,46.6 93.8,48 90.6,48 90.35,47.75 IC502.10
REG_4_QD
  Top 0.25: N803.1 96,47 94.2,48.8 78,48.8 77.6,48.4 77.6,45.86 IC502.15
REG_LOAD
  Top 0.25: IC102.11 TP105.1
  Bottom 0.25: IC202.9 92.89,89.69 91.6,88.4 91.6,82 92.89,80.71 IC302.9 92.89,75.29 91.6,74 91.6,65.6 92.89,64.31 IC402.9 92.89,58.89 91.6,57.6 91.6,51.2 92.89,49.91 IC502.9 92.89,42.09 92,41.2 90.2,41.2 89,40 89,32.8 87.8,31.6 87.8,15 89.8,13 97,13 97.8,13.8 97.8,14.61 IC102.11
RSV_IN_1
  Bottom 0.25: TP601.1 74.8,30.4 RN601.2 74.8,25.8 74.6,25.6 74.6,23.83 IC101.8
RSV_IN_2
  Bottom 0.25: TP602.1 70.9,29.6 70,29.6 69.72,29.32 RN601.4 69.72,26.88 72.08,24.52 IC101.9
RSV_IN_3
  Top 0.25: IC101.12 64.46,25.66 64.6,25.8 64.6,27.68 RN601.6 64.64,29.36 64.5,29.5 TP603.1
RSV_IN_4
  Top 0.25: IC101.13 61.92,25.72 62.1,25.9 RN601.7 62.1,29.5 62,29.6 TP604.1
RSV_OUT_1
  Bottom 0.25: IC101.10 69.54,24.86 68.6,25.8 68.6,29.8 TP605.1
RSV_OUT_2
  Top 0.25: IC101.11 67,25.6 66,26.6 66,29.6 67,30.6 TP606.1
SH_1_DS
  Bottom 0.25: IC201.1 47.69,86.19 TP201.1 N201.2
SH_1_DS1
  Bottom 0.25: N301.2 55.8,73.4 55.4,73 50,73 49.4,72.4 49.4,70.21 IC301.1 49.38,67.32 TP301.1
SH_1_DS2
  Bottom 0.25: N401.2 55.8,57.6 55.2,57 50.2,57 49.4,56.2 49.4,54.21 IC401.1 49.38,51.12 TP401.1
SH_1_DS3
  Bottom 0.25: N501.2 55.8,42 55.2,41.4 50.4,41.4 49.38,40.38 IC501.1 49.38,35.32 TP501.1
SH_1_QA
  Bottom 0.25: IC201.13 51.92,97.12 53.6,98.8 88,98.8 89.2,97.6 89.2,84.8 88.4,84 83,84 82.73,84.27 IC202.4
SH_1_QB
  Bottom 0.25: IC201.12 54.46,96.66 55.8,98 85.6,98 86.6,97 86.6,91 85.27,89.67 IC202.5
SH_1_QC
  Bottom 0.25: IC201.11 57,96.4 57.8,97.2 84.6,97.2 85.27,96.53 IC202.12
SH_1_QD
  Bottom 0.25: IC202.13 82.73,95.87 82.2,96.4 60,96.4 59.54,95.94 IC201.10 59.54,89.94 58.4,88.8 58.4,84.2 55.8,81.6 N301.1
SH_2_QA  (via drill 0.3)
  Top 0.25: IC301.13 51.92,75.48 52.4,75 67.6,75 71.4,78.8 v73.4,78.8
  Bottom 0.25: IC302.4 82.73,72.87 81.6,74 77.6,74 76.4,75.2 76.4,79.2 75.8,79.8 74.4,79.8 v73.4,78.8
SH_2_QB  (via drill 0.3)
  Top 0.25: IC301.12 54.46,76.14 54.8,75.8 67.4,75.8 71.2,79.6 v72.4,79.6
  Bottom 0.25: IC302.5 85.27,72.93 83.2,75 80,75 79,76 79,79.6 77.8,80.8 73.6,80.8 v72.4,79.6
SH_2_QC  (via drill 0.3)
  Top 0.25: IC301.11 57,80.2 58.2,81.4 76.6,81.4 77.8,82.6 84.6,82.6 v85.2,82
  Bottom 0.25: IC302.12 85.2,77.88 v85.2,82
SH_2_QD  (via drill 0.3)
  Top 0.25: IC301.10 59.54,79.74 60.2,80.4 76.8,80.4 78.2,81.8 v82,81.8
  Bottom 0.25: IC302.13 82.73,81.07 v82,81.8 | IC301.10 59.54,73.54 58.4,72.4 58.4,68.6 55.8,66 N401.1
SH_3_QA  (via drill 0.3)
  Top 0.25: v74.8,67.6 53.2,67.6 52,66.4 52,61.89 IC401.13
  Bottom 0.25: IC402.4 82.73,52.07 83.2,51.6 86,51.6 86.4,52 86.4,57.2 89,59.8 89,66.6 87.6,68 75.2,68 v74.8,67.6
SH_3_QB  (via drill 0.3)
  Top 0.25: IC401.12 54.46,65.26 55.6,66.4 75.6,66.4 v76,66.8
  Bottom 0.25: IC402.5 85.27,58.87 86.4,60 86.4,66 85.6,66.8 v76,66.8
SH_3_QC  (via drill 0.3)
  Top 0.25: v77.6,65.6 58,65.6 57,64.6 IC401.11
  Bottom 0.25: IC402.12 85.27,64.73 84.4,65.6 v77.6,65.6
SH_3_QD  (via drill 0.3)
  Top 0.25: v76.4,64.4 60,64.4 59.6,64 59.6,61.87 IC401.10
  Bottom 0.25: IC402.13 82.73,63.67 82,64.4 v76.4,64.4 | IC401.10 59.54,57.94 58.4,56.8 58.4,52.2 55.8,49.6 N501.1
SH_4_QA  (via drill 0.3)
  Top 0.25: v76.8,51.8 75.8,50.8 54.8,50.8 51.92,47.92 IC501.13
  Bottom 0.25: IC502.4 82.73,36.27 83.2,35.8 86,35.8 86.6,36.4 86.6,41.4 89,43.8 89,47.8 87,49.8 78.8,49.8 v76.8,51.8
SH_4_QB  (via drill 0.3)
  Top 0.25: IC501.12 54.46,49.06 55.4,50 76.2,50 v76.8,50.6
  Bottom 0.25: v76.8,50.6 78.4,49 85.8,49 86.6,48.2 86.6,44.8 85.27,43.47 IC502.5
SH_4_QC  (via drill 0.3)
  Top 0.25: IC501.11 57,48.6 57.6,49.2 v76.8,49.2
  Bottom 0.25: IC502.12 85.27,47.93 85,48.2 77.8,48.2 v76.8,49.2
SH_4_QD
  Top 0.25: IC501.10 59.54,47.94 60,48.4 75.8,48.4 76.4,47.8 76.4,44.4 77.2,43.6 82.4,43.6 82.8,44 82.8,45.74 IC502.13
TIM_1
  Top 0.25: IC901.4 47.6,14.1 C903.1
  Bottom 0.25: IC901.5 IC901.4
TIM_2
  Top 0.25: 45.06,21.66 IC901.6 45.06,25.86 45.6,26.4 46.45,26.4 D901.C | 45.06,21.66 44.6,21.2 42.2,21.2 41.4,22 41.4,26.52 R901.1 | C902.1 49.7,21.9 49.4,21.6 45.12,21.6 45.06,21.66
  Bottom 0.25: IC901.2 42.52,19.12 45.06,21.66 IC901.6
TIM_3
  Top 0.25: R901.2 33.92,29.2 43.95,29.2 D901.A | R902.1 48.55,31 D901.A | IC901.7 42.52,25.92 42.8,26.2 43.75,26.2 D901.A
  Bottom 0.25: R904.B 10.4,8.5 10.4,3.6 11,3 22.2,3 25.8,6.6 RPH901.2 27.4,15.7 27.4,24.6 30.6,27.8 R901.2
TIM_OUT
  Top 0.25: IC901.3 45.06,5.14 46.6,3.6 116.52,3.6 R906.1
  Bottom 0.25: R905.1 R906.1
TIM_OUT_B
  Bottom 0.25: T901.B 129.77,3.71 R906.2
TIM_RA
  Bottom 0.25: R903.1 25.52,21.08 25.8,20.8 RPH901.1 25.8,19 22.2,15.4 R904.W 19.7,5.3 R904.A
V_LED  (via drill 0.3)
  Top 1: 154.2,27.92 154.2,12.4 138.6,12.4 137.2,11 137.2,6.6 136.6,6 T901.C | 154.2,27.92 154.2,60.08 | 154.2,60.08 v154.2,78 154.2,78.08 R710.1 R706.1 R716.1 R712.1 R705.1 R704.1 R711.1 | R810.1 R811.1 R812.1 R814.1 154.2,27.92 | R718.1 R804.1 R805.1 R806.1 154.2,60.08
  Bottom 0.25: R717.1 158,78 v154.2,78

## Text on the board
Top: TOP | GND
Bottom: BOT
tPlace: LED MATRIX | ~ | ~